# Altium project WT108.PrjPcb
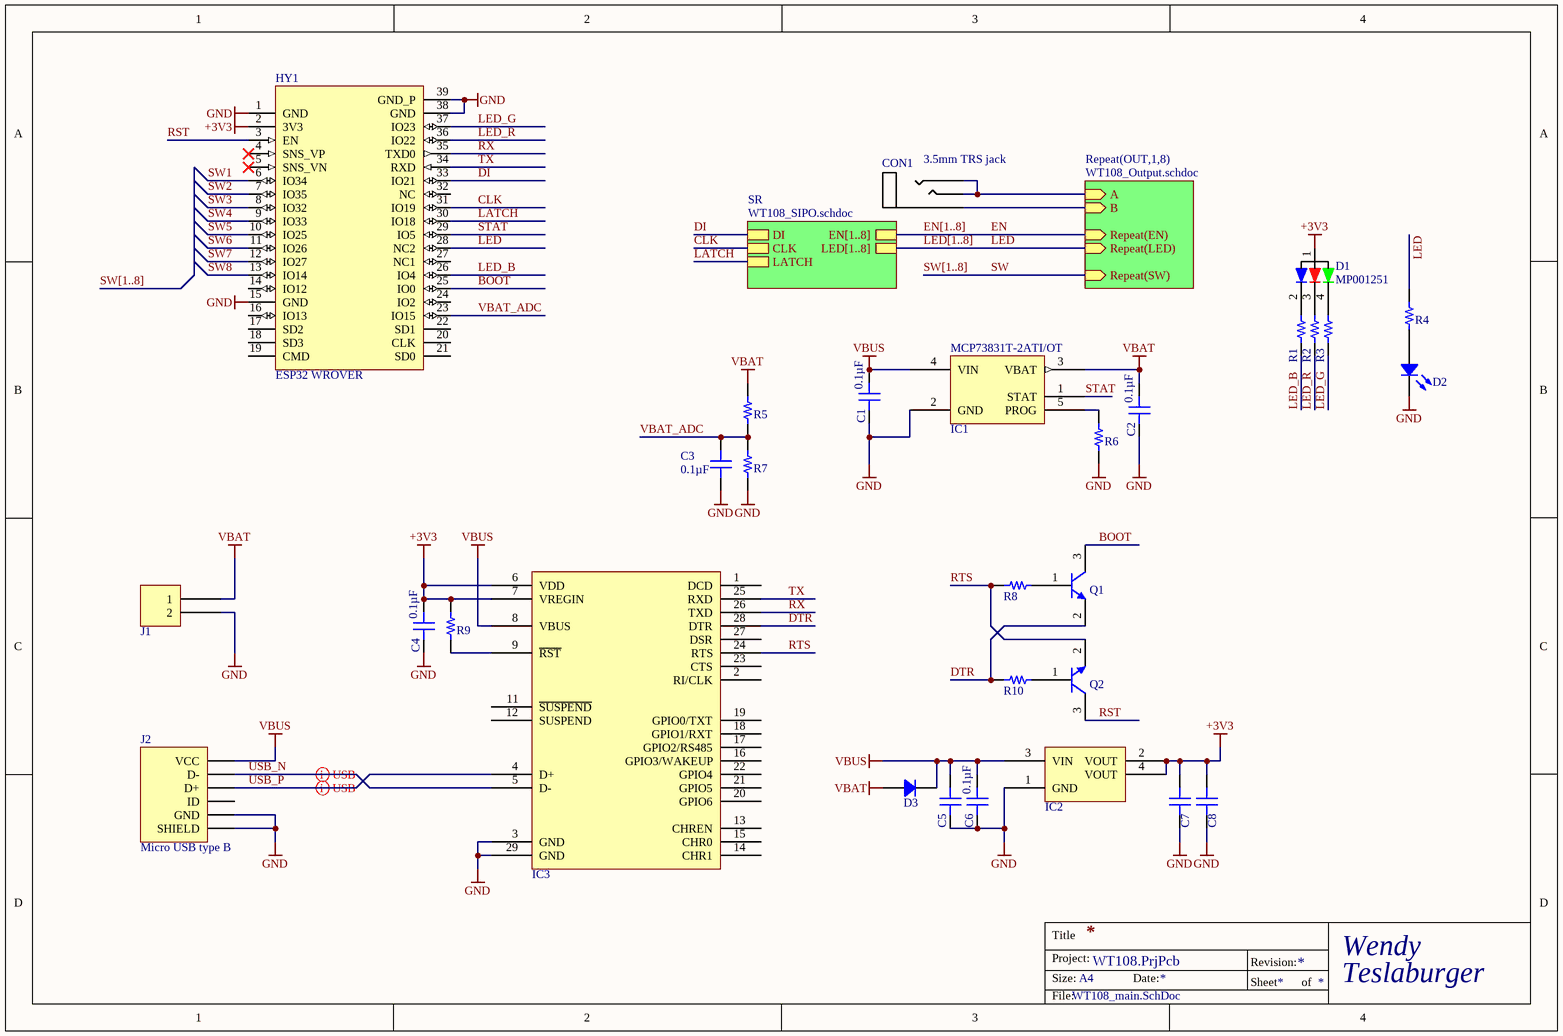
[diagram p0: WT108_main.SchDoc]
1 sheet, 30 parts. Net scope: hierarchical (ports join the sheet entries above them; power ports are global).
Board file: WT108.PcbDoc

## Sheet WT108_main.SchDoc
size A4

### Parts
C1  0.1µF  [CAP 0603_1608]
C2  0.1µF  [CAP 0603_1608]
C3  0.1µF  [CAP 0603_1608]
C4  0.1µF  [CAP 0603_1608]
C5  10µF  [CAP 0805_2012]  (value not drawn)
C6  0.1µF  [CAP 0603_1608]
C7  10µF  [CAP 0805_2012]  (value not drawn)
C8  10µF  [CAP 0805_2012]  (value not drawn)
CON1  3.5mm TRS jack  [3.5mm socket, side mount]
D1  MP001251  [3528RGB]
D2  Green  [LED 0805_2012 GREEN]  (value not drawn)
D3  RB162MM-30TR  [SOD123F]  (value not drawn)
HY1  ESP32 WROVER  [ESP32 _WROVER]
IC1  MCP73831T-2ATI/OT  [MICROCHIP SOT-23-5 OT]
IC2  LD1117AS33TR  [ST SOT-223]  (value not drawn)
IC3  CP2102N-A02-GQFN28R  [SILICON LABS QFN-28 5x5MM]  (value not drawn)
J1  B2B-PH-K-S(LF)(SN)  [JST B2B-PH-K]  (value not drawn)
J2  Micro USB type B  [10118194]
Q1  BC849BLT1G  [ON SEMI SOT-23-3]  (value not drawn)
Q2  BC849BLT1G  [ON SEMI SOT-23-3]  (value not drawn)
R1  120 Ohms  [RES 0603_1608]  (value not drawn)
R2  120 Ohms  [RES 0603_1608]  (value not drawn)
R3  120 Ohms  [RES 0603_1608]  (value not drawn)
R4  120 Ohms  [RES 0603_1608]  (value not drawn)
R5  10 kOhms  [RES 0603_1608]  (value not drawn)
R6  10 kOhms  [RES 0603_1608]  (value not drawn)
R7  10 kOhms  [RES 0603_1608]  (value not drawn)
R8  10 kOhms  [RES 0603_1608]  (value not drawn)
R9  10 kOhms  [RES 0603_1608]  (value not drawn)
R10  10 kOhms  [RES 0603_1608]  (value not drawn)

### Sub-sheets
Repeat(OUT,1,8) = WT108_Output.schdoc (file not in this document): Repeat(EN) (in), B (in), A (in), Repeat(SW) (in), Repeat(LED) (in)
SR = WT108_SIPO.schdoc (file not in this document): EN[1..8], LED[1..8], DI, CLK, LATCH

### Nets
+3V3: C4.2 C7.2 C8.2 D1.1(COM) HY1.2(3V3) IC2.2(VOUT) IC2.4(VOUT) IC3.6(VDD) IC3.7(VREGIN) R9.1
GND: C1.1 C2.1 C3.1 C4.1 C5.1 C6.1 C7.1 C8.1 D2.2 HY1.1(GND) HY1.15(GND) HY1.38(GND) HY1.39(GND_P) IC1.2(GND) IC2.1(GND) IC3.3(GND) IC3.29(GND) J1.2 J2.5(GND) J2.SH(SHIELD) R6.1 R7.1
VBAT: C2.2 D3.1 IC1.3(VBAT) J1.1 R5.2
VBUS: C1.2 C5.2 C6.2 D3.2 IC1.4(VIN) IC2.3(VIN) IC3.8(VBUS) J2.1(VCC)
BOOT: HY1.25(IO0) Q1.3(C)
CLK: HY1.31(IO19) ; sheet SR/CLK
DI: HY1.33(IO21) ; sheet SR/DI
DTR: IC3.28(DTR) Q1.2(E) R10.1
EN: sheet Repeat(OUT,1,8)/Repeat(EN)
LATCH: HY1.30(IO18) ; sheet SR/LATCH
LED: HY1.28(NC2) R4.1 ; sheet Repeat(OUT,1,8)/Repeat(LED)
LED_B: HY1.26(IO4) R1.1
LED_G: HY1.37(IO23) R3.1
LED_R: HY1.36(IO22) R2.1
RST: HY1.3(EN) Q2.3(C)
RTS: IC3.24(RTS) Q2.2(E) R8.1
RX: HY1.35(TXD0) IC3.26(TXD)
STAT: HY1.29(IO5) IC1.1(STAT)
SW: sheet Repeat(OUT,1,8)/Repeat(SW)
SW1: HY1.6(IO34)
SW2: HY1.7(IO35)
SW3: HY1.8(IO32)
SW4: HY1.9(IO33)
SW5: HY1.10(IO25)
SW6: HY1.11(IO26)
SW7: HY1.12(IO27)
SW8: HY1.13(IO14)
TX: HY1.34(RXD) IC3.25(RXD)
USB_N: IC3.5(D-) J2.2(D-)
USB_P: IC3.4(D+) J2.3(D+)
VBAT_ADC: C3.2 HY1.23(IO15) R5.1 R7.2
NetCON1_R: CON1.R CON1.T ; sheet Repeat(OUT,1,8)/A
NetCON1_S: CON1.S ; sheet Repeat(OUT,1,8)/B
NetD1_2: D1.2(B) R1.2
NetD1_3: D1.3(R) R2.2
NetD1_4: D1.4(G) R3.2
NetD2_1: D2.1 R4.2
NetIC1_5: IC1.5(PROG) R6.2
NetIC3_9: IC3.9(~{RST}) R9.2
NetQ1_1: Q1.1(B) R8.2
NetQ2_1: Q2.1(B) R10.2

Not connected (* = marked no-connect by the designer): HY1 4(SNS_VP)* 5(SNS_VN)* 14(IO12) 16(IO13) 17(SD2) 18(SD3) 19(CMD) 20(CLK) 21(SD0) 22(SD1) 24(IO2) 27(NC1) 32(NC); IC3 1(DCD) 2(RI/CLK) 11(~{SUSPEND}) 12(SUSPEND) 13(CHREN) 14(CHR1) 15(CHR0) 16(GPIO3/WAKEUP) 17(GPIO2/RS485) 18(GPIO1/RXT) 19(GPIO0/TXT) 20(GPIO6) 21(GPIO5) 22(GPIO4) 23(CTS) 27(DSR); J2 4(ID)

### Buses and harness runs
bus EN[1..8] = sheet SR/EN[1..8]
bus LED[1..8] = sheet SR/LED[1..8]
bus SW[1..8]

### Layout directives
differential pair: USB_N, USB_P

### Notes on the sheet
- Title
- Size:
- Project:
- A4
- Date:
- Revision:
- Sheet
- of
- Wendy
- Teslaburger
- File:

### Library data of the parts
C1-C4 C6 = C0603C104K5RAC7411: CAP CER 0.1UF 50V X7R 0603; Manufacturer: KEMET; Tolerance: ±10%; Applications: Bypass, Decoupling; Capacitance: 0.1µF; ComponentLink1Description: Datasheet; ComponentLink1URL: https://api.kemet.com/component-edge/download/datasheet/C0603C104K5RAC7411.pdf; ComponentLink2Description: DigiKey Link; ComponentLink2URL: http://digikey.com/product-detail/en/kemet/C0603C104K5RAC7411/399-7374-2-ND/3317013; Device Package: 0603 (1608 Metric); LastUpdated: 02/09/2020 01:03:36; Lifecycle Status: Active; Part Number: C0603C104K5RAC7411; Minimum Order: 15000; Mounting Type: Surface Mount, MLCC; Operating Temperature: -55°C ~ 125°C; Package / Case: 0603 (1608 Metric); Packaging: TapeAndReel; PartId: 2233; Part Status: Active; Price: 0.02; Series: SMD Comm X7R; Size / Dimension: 0.063" L x 0.031" W (1.60mm x 0.80mm); Supplier 1: DigiKey; Supplier Part Number 1: 399-7374-2-ND; Temperature Coefficient: X7R; Thickness (Max): 0.035" (0.90mm); Value: 0.1µF; Voltage - Rated: 50V
C5 C7 C8 = GCM21BR70J106KE22K: CAP CER 10UF 6.3V X7R 0805; Manufacturer: Murata Electronics; Tolerance: ±10%; Applications: Automotive; Capacitance: 10µF; ComponentLink1Description: Datasheet; ComponentLink1URL: https://search.murata.co.jp/Ceramy/image/img/A01X/G101/ENG/GCM21BR70J106KE22-01.pdf; ComponentLink2Description: DigiKey Link; ComponentLink2URL: http://digikey.com/product-detail/en/murata-electronics/GCM21BR70J106KE22K/490-14361-1-ND/6606822; Device Package: 0805 (2012 Metric); LastUpdated: 02/09/2020 01:04:17; Lifecycle Status: Active; Part Number: GCM21BR70J106KE22K; Minimum Order: 1; Mounting Type: Surface Mount, MLCC; Operating Temperature: -55°C ~ 125°C; Package / Case: 0805 (2012 Metric); Packaging: TapeAndReel; PartId: 15096; Part Status: Active; Price: 0.08; Ratings: AEC-Q200; Series: GCM; Size / Dimension: 0.079" L x 0.049" W (2.00mm x 1.25mm); Supplier 1: DigiKey; Supplier Part Number 1: 490-14361-1-ND; Temperature Coefficient: X7R; Thickness (Max): 0.055" (1.40mm); Value: 10µF; Voltage - Rated: 6.3V
D1 = MP001251: LED, Red, Green, Blue, SMD, 3.5mm x 2.8mm, 120 °, Rectangular, R 20mA, G 20mA, B 20mA
D2 = 5990181007F: LED GREEN 0805 SMD; Manufacturer: Dialight; Configuration: Standard; Current - Test: 20mA; Lens Color: 0.80mm; Lens Size: 1.40mm x 1.25mm; Lens Style: Rectangle with Flat Top; Millicandela Rating: 340mcd; Viewing Angle: 140°; Voltage - Forward (Vf) (Typ): 3.2V; Wavelength - Dominant: 525nm; Color: Green; ComponentLink1Description: Datasheet; ComponentLink1URL: http://www.dialightsignalsandcomponents.com/Assets/Brochures_And_Catalogs/Indication/CBI_SMD_new/Dialight_CBI_data_599-0805_Apr2018.pdf; ComponentLink2Description: DigiKey Link; ComponentLink2URL: http://digikey.com/product-detail/en/dialight/5990181007F/350-4358-1-ND/9385464; Device Package: 0805 (2012 Metric); Height (Max): 0.80mm; LastUpdated: 02/09/2020 01:21:05; Lifecycle Status: Active; Part Number: 5990181007F; Minimum Order: 1; Mounting Type: Surface Mount; Package / Case: 0805 (2012 Metric); Packaging: TapeAndReel; PartId: 272; Part Status: Active; Price: 0.16; Series: 599; Size / Dimension: 2.00mm L x 1.25mm W; Supplier 1: DigiKey; Supplier Part Number 1: 350-4358-1-ND; Supplier Device Package: 0805; Value: Green
D3 = RB162MM-30TR: DIODE SCHOTTKY 30V 1A PMDU; Manufacturer: Rohm Semiconductor; Current - Reverse Leakage @ Vr: 100µA @ 30V; Speed: Fast Recovery =< 500ns, > 200mA (Io); Voltage - Forward (Vf) (Max) @ If: 520mV @ 1A; ComponentLink1Description: Datasheet; ComponentLink1URL: https://www.rohm.com/datasheet/RB162MM-30/rb162mm-30-e; ComponentLink2Description: DigiKey Link; ComponentLink2URL: http://digikey.com/product-detail/en/rohm-semiconductor/RB162MM-30TR/RB162MM-30CT-ND/5720307; Current - Average Rectified (Io): 1A; Diode Type: Schottky; LastUpdated: 02/09/2020 01:19:10; Lifecycle Status: Active; Part Number: RB162MM-30TR; Minimum Order: 1; Mounting Type: Surface Mount; Operating Temperature - Junction: 150°C (Max); Package / Case: SOD-123F; Packaging: TapeAndReel; PartId: 2482; Part Status: Active; Price: 0.11; Series: -; Supplier 1: DigiKey; Supplier Part Number 1: RB162MM-30CT-ND; Supplier Device Package: PMDU; Voltage - DC Reverse (Vr) (Max): 30V
HY1 = ESP32_WROVER
IC1 = MCP73831T-2ATI/OT: IC CONTROLLR LI-ION 4.2V SOT23-5; Manufacturer: Microchip Technology; Battery Chemistry: Lithium Ion/Polymer; Charge Current - Max: 500mA; Current - Charging: Constant - Programmable; Fault Protection: Over Voltage; Number of Cells: 1; Programmable Features: Current; Voltage - Supply (Max): 6V; Battery Pack Voltage: 4.2V; ComponentLink1Description: Datasheet; ComponentLink1URL: http://ww1.microchip.com/downloads/en/DeviceDoc/20001984g.pdf; ComponentLink2Description: DigiKey Link; ComponentLink2URL: //digikey.com/product-detail/en/microchip-technology/MCP73831T-2ATI-OT/MCP73831T-2ATI-OTTR-ND/964303; Device Package: SC-74A, SOT-753; LastUpdated: 03/12/2019 23:33:03; Lifecycle Status: 0; Part Number: MCP73831T-2ATI/OT; Minimum Order: 1; Mounting Type: Surface Mount; Operating Temperature: -40°C ~ 85°C (TA); Package / Case: SC-74A, SOT-753; Packaging: TapeAndReel; PartId: 1; Part Status: Active; Price: 0.42; Series: -; Supplier 1: DigiKey; Supplier Part Number 1: MCP73831T-2ATI/OTTR-ND; Supplier Device Package: SOT-23-5
IC2 = LD1117AS33TR: IC REG LINEAR 3.3V 1A SOT223; Manufacturer: STMicroelectronics; Current - Quiescent (Iq): 10mA; Number of Regulators: 1; Output Configuration: Positive; Output Type: Fixed; Protection Features: Over Current, Over Temperature; PSRR: 75dB (120Hz); Voltage Dropout (Max): 1.3V @ 1A; Voltage - Input (Max): 15V; ComponentLink1Description: Datasheet; ComponentLink1URL: http://www.st.com/content/ccc/resource/technical/document/datasheet/a5/c3/3f/c9/2b/15/40/49/CD00002116.pdf/files/CD00002116.pdf/jcr:content/translations/en.CD00002116.pdf; ComponentLink2Description: DigiKey Link; ComponentLink2URL: http://digikey.com/product-detail/en/stmicroelectronics/LD1117AS33TR/497-1228-1-ND/586228; Current - Output: 1A; LastUpdated: 02/09/2020 01:24:40; Lifecycle Status: Active; Part Number: LD1117AS33TR; Minimum Order: 1; Mounting Type: Surface Mount; Package / Case: TO-261-4, TO-261AA; Packaging: TapeAndReel; Part Status: Active; Price: 0.26; Series: -; Supplier 1: DigiKey; Supplier Part Number 1: 497-1228-1-ND; Supplier Device Package: SOT-223; Voltage - Output (Min/Fixed): 3.3V
IC3 = CP2102N-A02-GQFN28R: IC USB TO UART BRIDGE QFN28; Manufacturer: Silicon Labs; Current - Supply: 9.5mA; Function: Bridge, USB to UART; Standards: USB 2.0; Voltage - Supply: 3V ~ 3.6V; ComponentLink1Description: Datasheet; ComponentLink1URL: https://www.silabs.com/documents/public/data-sheets/cp2102n-datasheet.pdf; ComponentLink2Description: DigiKey Link; ComponentLink2URL: http://digikey.com/product-detail/en/silicon-labs/CP2102N-A02-GQFN28R/336-5890-1-ND/9863483; Interface: UART; LastUpdated: 31/07/2020 16:26:30; Lifecycle Status: Active; Part Number: CP2102N-A02-GQFN28R; Minimum Order: 1; Operating Temperature: -40°C ~ 85°C (TA); Package / Case: 28-WFQFN Exposed Pad; Packaging: TapeAndReel; Part Status: Active; Price: 1.23; Protocol: USB; Series: USBXpress™; Supplier 1: DigiKey; Supplier Part Number 1: 336-5890-1-ND; Supplier Device Package: 28-QFN (5x5)
J1 = B2B-PH-K-S(LF)(SN): CONN HEADER VERT 2POS 2MM; Manufacturer: JST Sales America Inc.; Contact Length - Mating: 0.130" (3.30mm); Contact Length - Post: 0.134" (3.40mm); Current Rating (Amps): 2A; Material Flammability Rating: UL94 V-0; Number of Positions: 2; Number of Positions Loaded: All; Overall Contact Length: 0.333" (8.45mm); Pitch - Mating: 0.079" (2.00mm); Shrouding: Shrouded - 4 Wall; Style: Board to Cable/Wire; Voltage Rating: 100V; ComponentLink1Description: Datasheet; ComponentLink1URL: http://www.jst-mfg.com/product/pdf/eng/ePH.pdf; ComponentLink2Description: DigiKey Link; ComponentLink2URL: http://digikey.com/product-detail/en/jst-sales-america-inc/B2B-PH-K-S-LF-SN/455-1704-ND/926611; Connector Type: Header; Contact Finish - Mating: Tin; Contact Finish - Post: Tin; Contact Material: Brass; Contact Shape: Square; Contact Type: Male Pin; Fastening Type: Detent Lock; Insulation Color: Natural; Insulation Height: 0.236" (6.00mm); Insulation Material: Polyamide (PA66), Nylon 6/6; LastUpdated: 03/01/2020 23:40:58; Lifecycle Status: Active; Part Number: B2B-PH-K-S(LF)(SN); Minimum Order: 1; Mounting Type: Through Hole; Number of Rows: 1; Operating Temperature: -25°C ~ 85°C; Packaging: Bulk; PartId: 11; Part Status: Active; Price: 0.17; Series: PH; Supplier 1: DigiKey; Supplier Part Number 1: 455-1704-ND; Termination: Press-Fit, Solder
J2 = MicroUSB_TypeB
Q1 Q2 = BC849BLT1G: TRANS NPN 30V 0.1A SOT-23; Manufacturer: ON Semiconductor; Current - Collector Cutoff (Max): 15nA (ICBO); Current - Collector (Ic) (Max): 100mA; DC Current Gain (hFE) (Min) @ Ic, Vce: 200 @ 2mA, 5V; Frequency - Transition: 100MHz; Power - Max: 300mW; Vce Saturation (Max) @ Ib, Ic: 600mV @ 5mA, 100mA; ComponentLink1Description: Datasheet; ComponentLink1URL: http://www.onsemi.com/pub/Collateral/BC846ALT1-D.PDF; ComponentLink2Description: DigiKey Link; ComponentLink2URL: http://digikey.com/product-detail/en/on-semiconductor/BC849BLT1G/BC849BLT1GOSCT-ND/2623442; LastUpdated: 02/09/2020 01:30:08; Lifecycle Status: Active; Part Number: BC849BLT1G; Minimum Order: 1; Mounting Type: Surface Mount; Operating Temperature: -55°C ~ 150°C (TJ); Package / Case: TO-236-3, SC-59, SOT-23-3; Packaging: TapeAndReel; PartId: 138; Part Status: Active; Price: 0.02; Series: -; Supplier 1: DigiKey; Supplier Part Number 1: BC849BLT1GOSCT-ND; Supplier Device Package: SOT-23-3 (TO-236); Transistor Type: NPN; Voltage - Collector Emitter Breakdown (Max): 30V
R1-R4 = RT0603DRE07120RL: RES SMD 120 OHM 0.5% 1/10W 0603; Manufacturer: Yageo; Power (Watts): 0.1W, 1/10W; Temperature Coefficient: ±50ppm/°C; ComponentLink1Description: Datasheet; ComponentLink1URL: https://www.yageo.com/upload/media/product/productsearch/datasheet/rchip/PYu-RT_1-to-0.01_RoHS_L_11.pdf; ComponentLink2Description: DigiKey Link; ComponentLink2URL: http://digikey.com/product-detail/en/yageo/RT0603DRE07120RL/311-2409-1-ND/6128828; Composition: Thin Film; Device Package: 0603 (1608 Metric); Height - Seated (Max): 0.022" (0.55mm); LastUpdated: 02/09/2020 01:10:15; Lifecycle Status: Active; Part Number: RT0603DRE07120RL; Minimum Order: 1; Number of Terminations: 2; Operating Temperature: -55°C ~ 155°C; Package / Case: 0603 (1608 Metric); Packaging: TapeAndReel; PartId: 9567; Part Status: Active; Price: 0.01; Resistance: 120 Ohms; Series: RT; Size / Dimension: 0.063" L x 0.031" W (1.60mm x 0.80mm); Supplier 1: DigiKey; Supplier Part Number 1: 311-2409-1-ND; Supplier Device Package: 0603; Tolerance: ±0.5%; Value: 120 Ohms
R5-R10 = RT0603DRD0710KL: RES SMD 10K OHM 0.5% 1/10W 0603; Manufacturer: Yageo; Power (Watts): 0.1W, 1/10W; Temperature Coefficient: ±25ppm/°C; ComponentLink1Description: Datasheet; ComponentLink1URL: https://www.yageo.com/upload/media/product/productsearch/datasheet/rchip/PYu-RT_1-to-0.01_RoHS_L_11.pdf; ComponentLink2Description: DigiKey Link; ComponentLink2URL: http://digikey.com/product-detail/en/yageo/RT0603DRD0710KL/311-10KDCT-ND/1035680; Composition: Thin Film; Device Package: 0603 (1608 Metric); Height - Seated (Max): 0.022" (0.55mm); LastUpdated: 02/09/2020 01:10:23; Lifecycle Status: Active; Part Number: RT0603DRD0710KL; Minimum Order: 1; Number of Terminations: 2; Operating Temperature: -55°C ~ 155°C; Package / Case: 0603 (1608 Metric); Packaging: TapeAndReel; PartId: 5487; Part Status: Active; Price: 0.02; Resistance: 10 kOhms; Series: RT; Size / Dimension: 0.063" L x 0.031" W (1.60mm x 0.80mm); Supplier 1: DigiKey; Supplier Part Number 1: 311-10KDCT-ND; Supplier Device Package: 0603; Tolerance: ±0.5%; Value: 10 kOhms